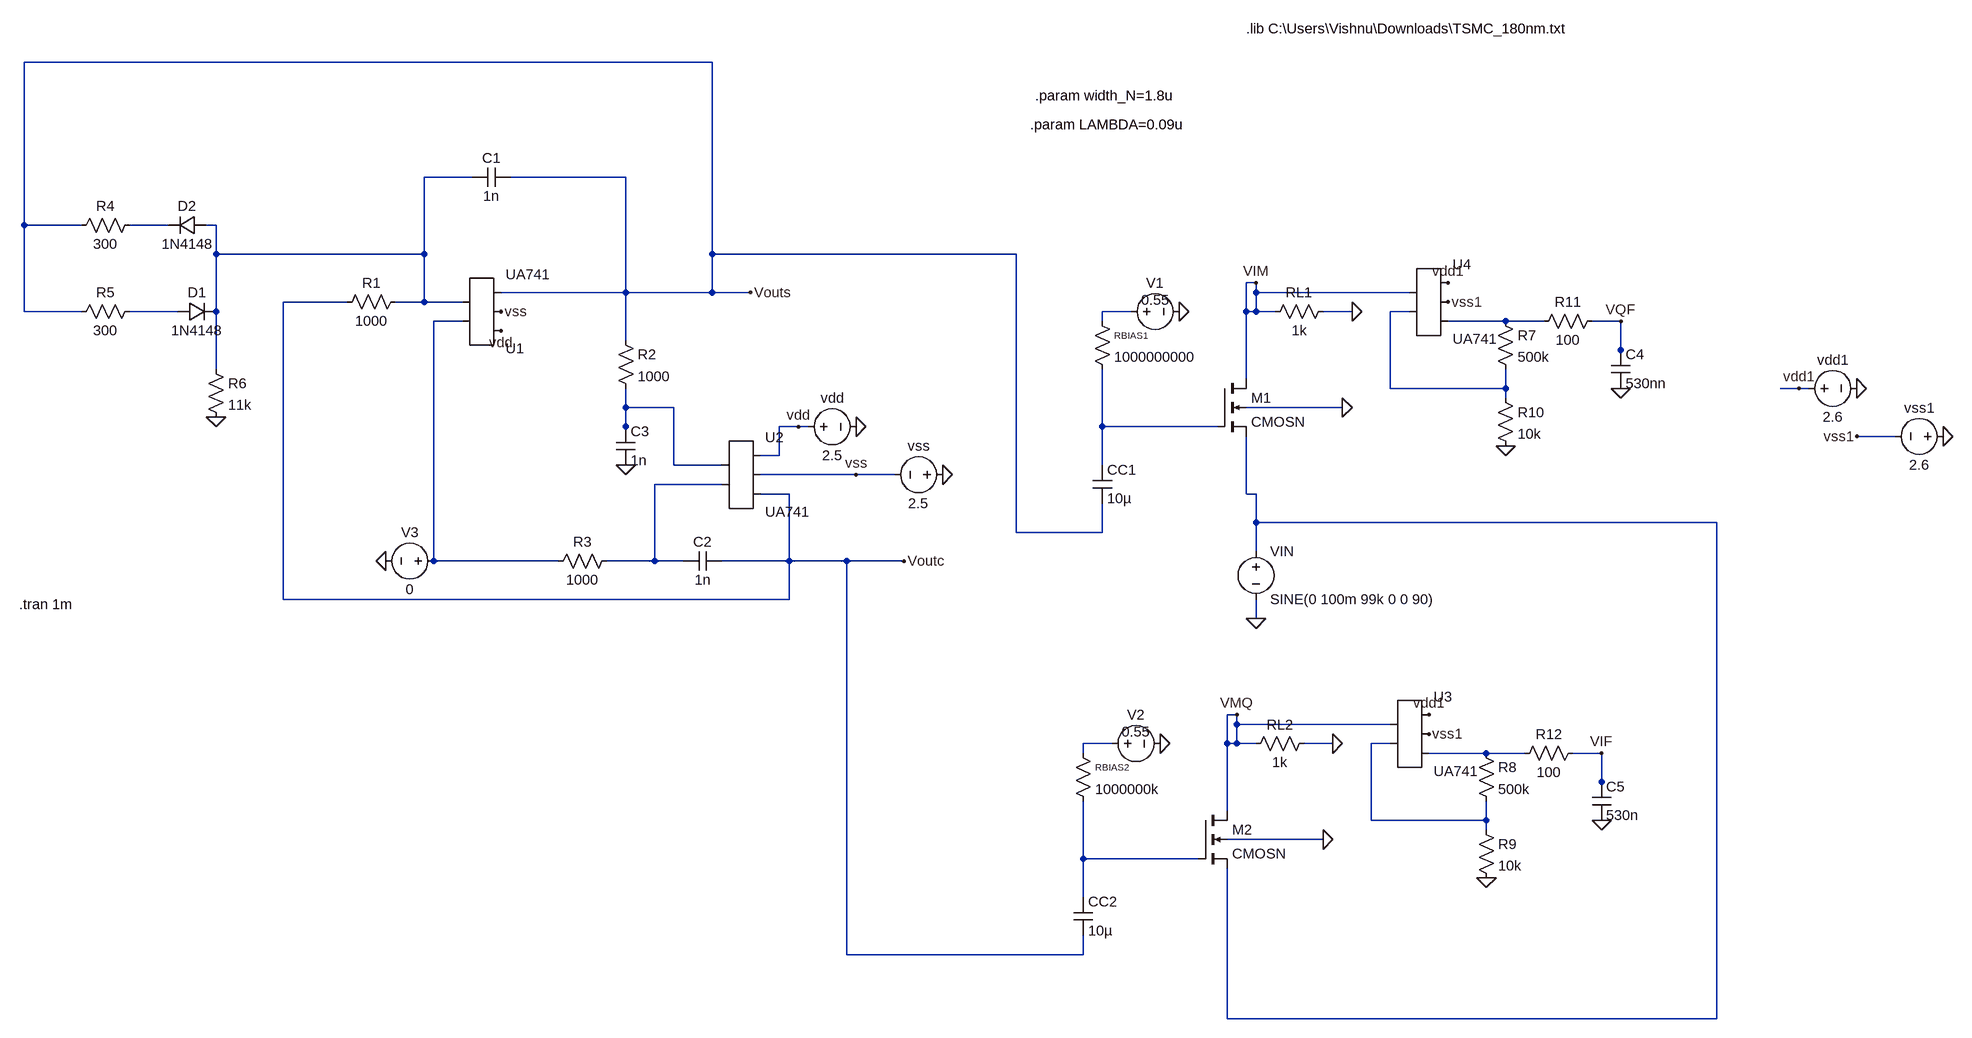
[diagram p0: schematic final circuit.asc]
final circuit.asc, the LTspice schematic file:
Version 4
SHEET 1 2788 1364
WIRE 608 -272 -544 -272
WIRE 208 -80 128 -80
WIRE 464 -80 272 -80
WIRE -544 0 -544 -272
WIRE -448 0 -544 0
WIRE -304 0 -368 0
WIRE -224 0 -240 0
WIRE -224 48 -224 0
WIRE 128 48 128 -80
WIRE 128 48 -224 48
WIRE 608 48 608 -272
WIRE 1136 48 608 48
WIRE 1536 96 1520 96
WIRE 464 112 464 -80
WIRE 464 112 256 112
WIRE 608 112 608 48
WIRE 608 112 464 112
WIRE 672 112 608 112
WIRE 1536 112 1536 96
WIRE 1792 112 1536 112
WIRE 0 128 -112 128
WIRE 128 128 128 48
WIRE 128 128 80 128
WIRE 192 128 128 128
WIRE -544 144 -544 0
WIRE -448 144 -544 144
WIRE -288 144 -368 144
WIRE -224 144 -224 48
WIRE 1328 144 1280 144
WIRE 1520 144 1520 96
WIRE 1536 144 1536 112
WIRE 1536 144 1520 144
WIRE 1568 144 1536 144
WIRE 1696 144 1648 144
WIRE 1792 144 1760 144
WIRE 192 160 144 160
WIRE 1280 160 1280 144
WIRE 1952 160 1856 160
WIRE 2016 160 1952 160
WIRE 2144 160 2096 160
WIRE 464 192 464 112
WIRE 2144 208 2144 160
WIRE 2144 224 2144 208
WIRE -224 240 -224 144
WIRE 1520 256 1520 144
WIRE 1760 272 1760 144
WIRE 1952 272 1952 240
WIRE 1952 272 1760 272
WIRE 2528 272 2496 272
WIRE 2544 272 2528 272
WIRE 1952 288 1952 272
WIRE 464 304 464 272
WIRE 544 304 464 304
WIRE 1680 304 1520 304
WIRE 464 336 464 304
WIRE 752 336 720 336
WIRE 768 336 752 336
WIRE 1280 336 1280 240
WIRE 1472 336 1280 336
WIRE 464 352 464 336
WIRE 2688 352 2624 352
WIRE 720 384 720 336
WIRE 720 384 688 384
WIRE 544 400 544 304
WIRE 624 400 544 400
WIRE 1280 400 1280 336
WIRE 848 416 688 416
WIRE 912 416 848 416
WIRE 624 432 512 432
WIRE 736 448 688 448
WIRE 1520 448 1520 352
WIRE 1536 448 1520 448
WIRE 1536 496 1536 448
WIRE 2304 496 1536 496
WIRE 1136 512 1136 48
WIRE 1280 512 1280 464
WIRE 1280 512 1136 512
WIRE 1536 544 1536 496
WIRE 144 560 144 160
WIRE 352 560 144 560
WIRE 512 560 512 432
WIRE 512 560 432 560
WIRE 560 560 512 560
WIRE 736 560 736 448
WIRE 736 560 624 560
WIRE 832 560 736 560
WIRE 928 560 832 560
WIRE -112 624 -112 128
WIRE 736 624 736 560
WIRE 736 624 -112 624
WIRE 1536 656 1536 624
WIRE 1504 848 1488 848
WIRE 1504 864 1504 848
WIRE 1760 864 1504 864
WIRE 1296 896 1248 896
WIRE 1488 896 1488 848
WIRE 1504 896 1504 864
WIRE 1504 896 1488 896
WIRE 1536 896 1504 896
WIRE 1664 896 1616 896
WIRE 1760 896 1728 896
WIRE 1248 912 1248 896
WIRE 1920 912 1824 912
WIRE 1984 912 1920 912
WIRE 2112 912 2064 912
WIRE 2112 960 2112 912
WIRE 2112 976 2112 960
WIRE 1488 1008 1488 896
WIRE 1728 1024 1728 896
WIRE 1920 1024 1920 992
WIRE 1920 1024 1728 1024
WIRE 1920 1040 1920 1024
WIRE 1648 1056 1488 1056
WIRE 1248 1088 1248 992
WIRE 1440 1088 1248 1088
WIRE 1248 1152 1248 1088
WIRE 832 1248 832 560
WIRE 1248 1248 1248 1216
WIRE 1248 1248 832 1248
WIRE 1488 1360 1488 1104
WIRE 2304 1360 2304 496
WIRE 2304 1360 1488 1360
FLAG 848 336 0
FLAG 992 416 0
FLAG 64 560 0
FLAG 464 400 0
FLAG -224 320 0
FLAG 672 112 Vouts
FLAG 928 560 Voutc
FLAG 848 416 vss
FLAG 752 336 vdd
FLAG 256 176 vdd
FLAG 256 144 vss
FLAG 1680 304 0
FLAG 1696 144 0
FLAG 1408 144 0
FLAG 1536 96 VIM
FLAG 1648 1056 0
FLAG 1664 896 0
FLAG 1376 896 0
FLAG 1504 848 VMQ
FLAG 1536 656 0
FLAG 1856 96 vdd1
FLAG 1856 128 vss1
FLAG 1952 368 0
FLAG 2144 272 0
FLAG 2144 160 VQF
FLAG 1824 848 vdd1
FLAG 1824 880 vss1
FLAG 1920 1120 0
FLAG 2112 1024 0
FLAG 2112 912 VIF
FLAG 2624 272 0
FLAG 2768 352 0
FLAG 2624 352 vss1
FLAG 2528 272 vdd1
SYMBOL AutoGenerated\\UA741 224 144 M180
SYMATTR InstName U1
SYMBOL AutoGenerated\\UA741 656 416 R0
SYMATTR InstName U2
SYMBOL voltage 752 336 R270
WINDOW 0 32 56 VTop 2
WINDOW 3 -32 56 VBottom 2
WINDOW 123 0 0 Left 0
WINDOW 39 0 0 Left 0
SYMATTR InstName vdd
SYMATTR Value 2.5
SYMBOL res 96 112 R90
WINDOW 0 0 56 VBottom 2
WINDOW 3 32 56 VTop 2
SYMATTR InstName R1
SYMATTR Value 1000
SYMBOL cap 272 -96 R90
WINDOW 0 0 32 VBottom 2
WINDOW 3 32 32 VTop 2
SYMATTR InstName C1
SYMATTR Value 1n
SYMBOL res 448 176 R0
SYMATTR InstName R2
SYMATTR Value 1000
SYMBOL cap 624 544 R90
WINDOW 0 0 32 VBottom 2
WINDOW 3 32 32 VTop 2
SYMATTR InstName C2
SYMATTR Value 1n
SYMBOL res 448 544 R90
WINDOW 0 0 56 VBottom 2
WINDOW 3 32 56 VTop 2
SYMATTR InstName R3
SYMATTR Value 1000
SYMBOL voltage 1008 416 R90
WINDOW 0 -32 56 VBottom 2
WINDOW 3 32 56 VTop 2
WINDOW 123 0 0 Left 0
WINDOW 39 0 0 Left 0
SYMATTR InstName vss
SYMATTR Value 2.5
SYMBOL voltage 160 560 R90
WINDOW 0 -32 56 VBottom 2
WINDOW 3 32 56 VTop 2
WINDOW 123 0 0 Left 0
WINDOW 39 0 0 Left 0
SYMATTR InstName V3
SYMATTR Value 0
SYMBOL cap 448 336 R0
SYMATTR InstName C3
SYMATTR Value 1n
SYMBOL res -352 -16 R90
WINDOW 0 0 56 VBottom 2
WINDOW 3 32 56 VTop 2
SYMATTR InstName R4
SYMATTR Value 300
SYMBOL diode -288 160 R270
WINDOW 0 32 32 VTop 2
WINDOW 3 0 32 VBottom 2
SYMATTR InstName D1
SYMATTR Value 1N4148
SYMBOL diode -240 -16 R90
WINDOW 0 0 32 VBottom 2
WINDOW 3 32 32 VTop 2
SYMATTR InstName D2
SYMATTR Value 1N4148
SYMBOL res -352 128 R90
WINDOW 0 0 56 VBottom 2
WINDOW 3 32 56 VTop 2
SYMATTR InstName R5
SYMATTR Value 300
SYMBOL res -240 224 R0
SYMATTR InstName R6
SYMATTR Value 11k
SYMBOL nmos4 1472 256 R0
SYMATTR InstName M1
SYMATTR Value CMOSN
SYMATTR Value2 l={2*LAMBDA} w={width_n} ad={5*width_n *LAMBDA} as={5*width_n *LAMBDA} pd={10*LAMBDA+2*width_n} ps={10*LAMBDA+2*width_n} m=1
SYMBOL res 1664 128 R90
WINDOW 0 0 56 VBottom 2
WINDOW 3 32 56 VTop 2
SYMATTR InstName RL1
SYMATTR Value 1k
SYMBOL res 1264 144 R0
WINDOW 0 36 40 Left 1
SYMATTR InstName RBIAS1
SYMATTR Value 1000000000
SYMBOL cap 1264 400 R0
SYMATTR InstName CC1
SYMATTR Value 10µ
SYMBOL voltage 1312 144 R270
WINDOW 0 32 56 VTop 2
WINDOW 3 4 56 VTop 2
WINDOW 123 0 0 Left 0
WINDOW 39 0 0 Left 0
SYMATTR InstName V1
SYMATTR Value 0.55
SYMBOL nmos4 1440 1008 R0
SYMATTR InstName M2
SYMATTR Value CMOSN
SYMATTR Value2 l={2*LAMBDA} w={width_n} ad={5*width_n *LAMBDA} as={5*width_n *LAMBDA} pd={10*LAMBDA+2*width_n} ps={10*LAMBDA+2*width_n} m=1
SYMBOL res 1632 880 R90
WINDOW 0 0 56 VBottom 2
WINDOW 3 32 56 VTop 2
SYMATTR InstName RL2
SYMATTR Value 1k
SYMBOL res 1232 896 R0
WINDOW 0 36 40 Left 1
SYMATTR InstName RBIAS2
SYMATTR Value 1000000k
SYMBOL cap 1232 1152 R0
SYMATTR InstName CC2
SYMATTR Value 10µ
SYMBOL voltage 1280 896 R270
WINDOW 0 32 56 VTop 2
WINDOW 3 4 56 VTop 2
WINDOW 123 0 0 Left 0
WINDOW 39 0 0 Left 0
SYMATTR InstName V2
SYMATTR Value 0.55
SYMBOL voltage 1536 528 R0
WINDOW 123 0 0 Left 0
WINDOW 39 0 0 Left 0
SYMATTR InstName VIN
SYMATTR Value SINE(0 100m 99k 0 0 90)
SYMBOL AutoGenerated\\UA741 1824 128 R0
SYMATTR InstName U4
SYMBOL res 1936 144 R0
SYMATTR InstName R7
SYMATTR Value 500k
SYMBOL res 1936 272 R0
SYMATTR InstName R10
SYMATTR Value 10k
SYMBOL res 2112 144 R90
WINDOW 0 0 56 VBottom 2
WINDOW 3 32 56 VTop 2
SYMATTR InstName R11
SYMATTR Value 100
SYMBOL cap 2128 208 R0
SYMATTR InstName C4
SYMATTR Value 530nn
SYMBOL AutoGenerated\\UA741 1792 880 R0
SYMATTR InstName U3
SYMBOL res 1904 896 R0
SYMATTR InstName R8
SYMATTR Value 500k
SYMBOL res 1904 1024 R0
SYMATTR InstName R9
SYMATTR Value 10k
SYMBOL res 2080 896 R90
WINDOW 0 0 56 VBottom 2
WINDOW 3 32 56 VTop 2
SYMATTR InstName R12
SYMATTR Value 100
SYMBOL cap 2096 960 R0
SYMATTR InstName C5
SYMATTR Value 530n
SYMBOL voltage 2528 272 R270
WINDOW 0 32 56 VTop 2
WINDOW 3 -32 56 VBottom 2
WINDOW 123 0 0 Left 0
WINDOW 39 0 0 Left 0
SYMATTR InstName vdd1
SYMATTR Value 2.6
SYMBOL voltage 2784 352 R90
WINDOW 0 -32 56 VBottom 2
WINDOW 3 32 56 VTop 2
WINDOW 123 0 0 Left 0
WINDOW 39 0 0 Left 0
SYMATTR InstName vss1
SYMATTR Value 2.6
TEXT -552 632 Left 2 !.tran 1m
TEXT 1160 -168 Left 2 !.param LAMBDA=0.09u
TEXT 1168 -216 Left 2 !.param width_N=1.8u
TEXT 1520 -328 Left 2 !.lib C:\\Users\\Vishnu\\Downloads\\TSMC_180nm.txt

The netlist it stands for:
* final circuit.asc
* U1: UA741 (symbol AutoGenerated\UA741 not available, pins judged from their places): pin1=N006 pin2=N001 pin3=vdd pin4=vss pin5=Vouts
* U2: UA741 (symbol AutoGenerated\UA741 not available, pins judged from their places): pin1=N008 pin2=N010 pin3=vdd pin4=vss pin5=Voutc
vdd vdd 0 2.5
R1 N001 Voutc 1000
C1 Vouts N001 1n
R2 Vouts N008 1000
C2 Voutc N010 1n
R3 N010 N006 1000
vss 0 vss 2.5
V3 N006 0 0
C3 N008 0 1n
R4 N002 Vouts 300
D1 N003 N001 1N4148
D2 N001 N002 1N4148
R5 N003 Vouts 300
R6 N001 0 11k
M1 VIM N009 N011 0 CMOSN l={2*LAMBDA} w={width_n} ad={5*width_n *LAMBDA} as={5*width_n *LAMBDA} pd={10*LAMBDA+2*width_n} ps={10*LAMBDA+2*width_n} m=1
RL1 0 VIM 1k
RBIAS1 N004 N009 1000000000
CC1 N009 Vouts 10µ
V1 N004 0 0.55
M2 VMQ N015 N011 0 CMOSN l={2*LAMBDA} w={width_n} ad={5*width_n *LAMBDA} as={5*width_n *LAMBDA} pd={10*LAMBDA+2*width_n} ps={10*LAMBDA+2*width_n} m=1
RL2 0 VMQ 1k
RBIAS2 N012 N015 1000000k
CC2 N015 Voutc 10µ
V2 N012 0 0.55
VIN N011 0 SINE(0 100m 99k 0 0 90)
* U4: UA741 (symbol AutoGenerated\UA741 not available, pins judged from their places): pin1=VIM pin2=N005 pin3=vdd1 pin4=vss1 pin5=N007
R7 N007 N005 500k
R10 N005 0 10k
R11 VQF N007 100
C4 VQF 0 530nn
* U3: UA741 (symbol AutoGenerated\UA741 not available, pins judged from their places): pin1=VMQ pin2=N013 pin3=vdd1 pin4=vss1 pin5=N014
R8 N014 N013 500k
R9 N013 0 10k
R12 VIF N014 100
C5 VIF 0 530n
vdd1 vdd1 0 2.6
vss1 0 vss1 2.6
.model D D
.lib standard.dio
.model NMOS NMOS
.model PMOS PMOS
.lib standard.mos
.tran 1m
.param LAMBDA=0.09u
.param width_N=1.8u
.lib C:\Users\Vishnu\Downloads\TSMC_180nm.txt
.backanno
.end